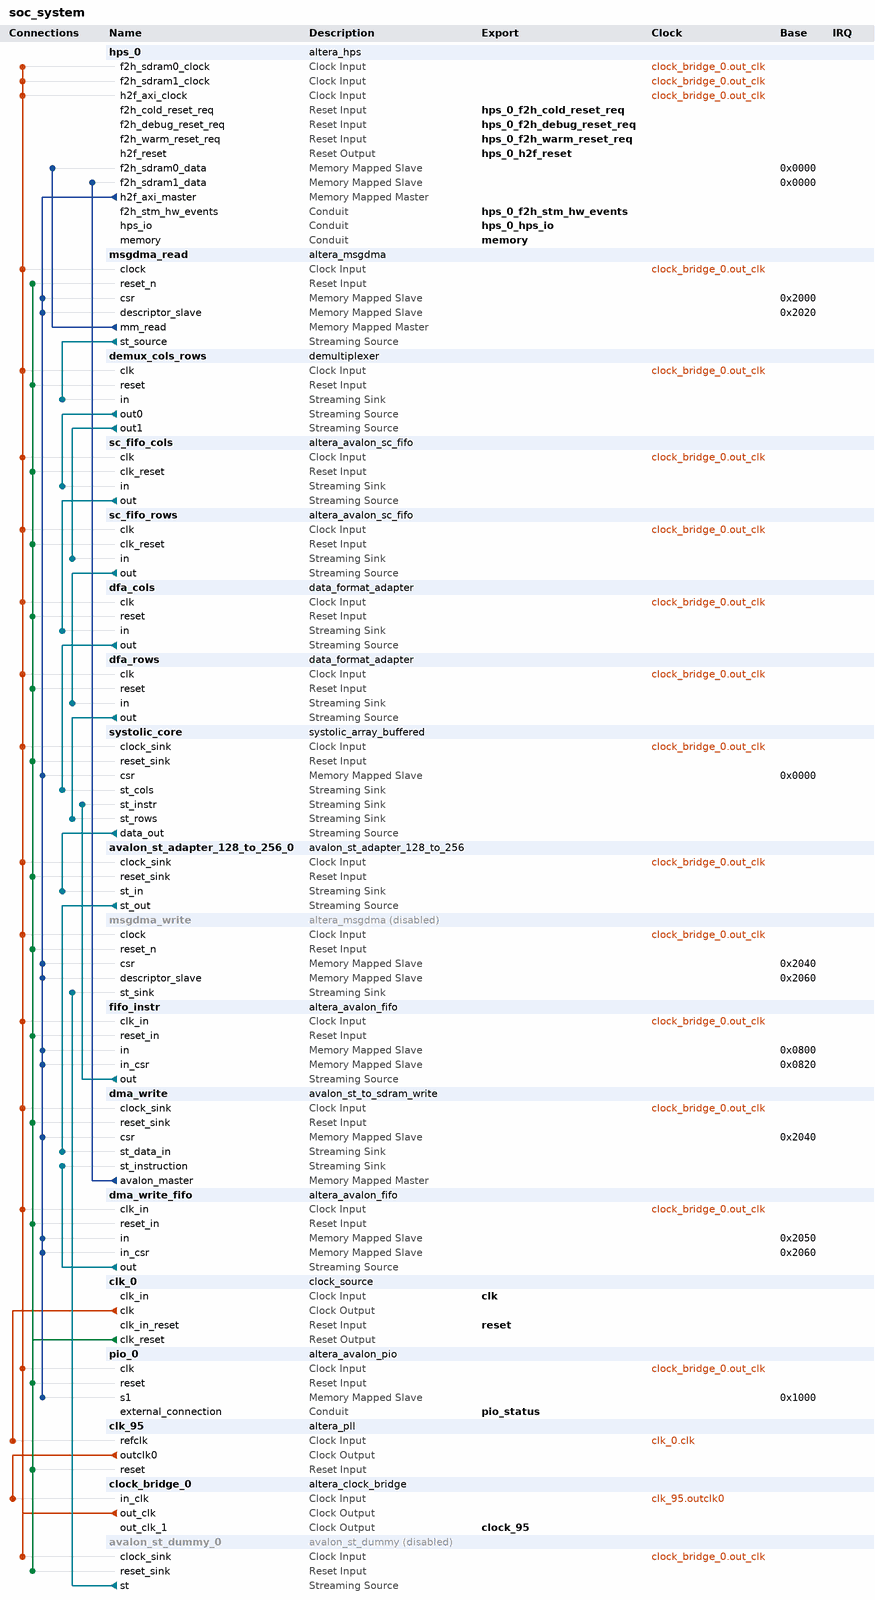
[diagram p0: system contents]
# Platform Designer (Qsys) system soc_system, Cyclone V 5CSEMA5F31C6
# Parameters at their usual value, and those the tool derives, are not listed.
package require -exact qsys 22.1
create_system soc_system
set_project_property DEVICE_FAMILY {Cyclone V}
set_project_property DEVICE 5CSEMA5F31C6

add_instance hps_0 altera_hps 22.1
set_instance_parameter_value hps_0 EMAC1_Mode RGMII
set_instance_parameter_value hps_0 EMAC1_PinMuxing {HPS I/O Set 0}
set_instance_parameter_value hps_0 F2SCLK_COLDRST_Enable true
set_instance_parameter_value hps_0 F2SCLK_DBGRST_Enable true
set_instance_parameter_value hps_0 F2SCLK_WARMRST_Enable true
set_instance_parameter_value hps_0 F2SDRAM_Type {Avalon-MM Read-Only,Avalon-MM Write-Only}
set_instance_parameter_value hps_0 F2SDRAM_Width 256,256
set_instance_parameter_value hps_0 F2SINTERRUPT_Enable false
set_instance_parameter_value hps_0 F2S_Width 0
set_instance_parameter_value hps_0 FPGA_PERIPHERAL_OUTPUT_CLOCK_FREQ_EMAC0_GTX_CLK 100
set_instance_parameter_value hps_0 FPGA_PERIPHERAL_OUTPUT_CLOCK_FREQ_EMAC0_MD_CLK 100.0
set_instance_parameter_value hps_0 FPGA_PERIPHERAL_OUTPUT_CLOCK_FREQ_EMAC1_GTX_CLK 100
set_instance_parameter_value hps_0 FPGA_PERIPHERAL_OUTPUT_CLOCK_FREQ_EMAC1_MD_CLK 100.0
set_instance_parameter_value hps_0 HPS_PROTOCOL DDR3
set_instance_parameter_value hps_0 I2C0_Mode I2C
set_instance_parameter_value hps_0 I2C0_PinMuxing {HPS I/O Set 0}
set_instance_parameter_value hps_0 I2C1_Mode I2C
set_instance_parameter_value hps_0 I2C1_PinMuxing {HPS I/O Set 0}
set_instance_parameter_value hps_0 LWH2F_Enable false
set_instance_parameter_value hps_0 MEM_BANKADDR_WIDTH 3
set_instance_parameter_value hps_0 MEM_CLK_FREQ 400.0
set_instance_parameter_value hps_0 MEM_COL_ADDR_WIDTH 10
set_instance_parameter_value hps_0 MEM_DQ_WIDTH 32
set_instance_parameter_value hps_0 MEM_DRV_STR RZQ/7
set_instance_parameter_value hps_0 MEM_ROW_ADDR_WIDTH 15
set_instance_parameter_value hps_0 MEM_RTT_NOM RZQ/4
set_instance_parameter_value hps_0 MEM_RTT_WR RZQ/4
set_instance_parameter_value hps_0 MEM_TCL 11
set_instance_parameter_value hps_0 MEM_TFAW_NS 30.0
set_instance_parameter_value hps_0 MEM_TRAS_NS 35.0
set_instance_parameter_value hps_0 MEM_TRCD_NS 13.75
set_instance_parameter_value hps_0 MEM_TRFC_NS 260.0
set_instance_parameter_value hps_0 MEM_TRP_NS 13.75
set_instance_parameter_value hps_0 MEM_VENDOR JEDEC
set_instance_parameter_value hps_0 MEM_WTCL 8
set_instance_parameter_value hps_0 QSPI_Mode {1 SS}
set_instance_parameter_value hps_0 QSPI_PinMuxing {HPS I/O Set 0}
set_instance_parameter_value hps_0 REF_CLK_FREQ 25.0
set_instance_parameter_value hps_0 S2FCLK_USER2CLK 5
set_instance_parameter_value hps_0 S2F_Width 2
set_instance_parameter_value hps_0 SDIO_Mode {4-bit Data}
set_instance_parameter_value hps_0 SDIO_PinMuxing {HPS I/O Set 0}
set_instance_parameter_value hps_0 SPIM1_Mode {Single Slave Select}
set_instance_parameter_value hps_0 SPIM1_PinMuxing {HPS I/O Set 0}
set_instance_parameter_value hps_0 STM_Enable true
set_instance_parameter_value hps_0 TIMING_BOARD_AC_SKEW 0.03
set_instance_parameter_value hps_0 TIMING_BOARD_AC_TO_CK_SKEW 0.0
set_instance_parameter_value hps_0 TIMING_BOARD_DQ_TO_DQS_SKEW 0.0
set_instance_parameter_value hps_0 TIMING_BOARD_MAX_CK_DELAY 0.03
set_instance_parameter_value hps_0 TIMING_BOARD_MAX_DQS_DELAY 0.02
set_instance_parameter_value hps_0 TIMING_BOARD_SKEW_BETWEEN_DQS 0.08
set_instance_parameter_value hps_0 TIMING_BOARD_SKEW_CKDQS_DIMM_MAX 0.16
set_instance_parameter_value hps_0 TIMING_BOARD_SKEW_CKDQS_DIMM_MIN 0.09
set_instance_parameter_value hps_0 TIMING_BOARD_SKEW_WITHIN_DQS 0.01
set_instance_parameter_value hps_0 TIMING_TDH 65
set_instance_parameter_value hps_0 TIMING_TDQSCK 255
set_instance_parameter_value hps_0 TIMING_TDQSQ 125
set_instance_parameter_value hps_0 TIMING_TDS 30
set_instance_parameter_value hps_0 TIMING_TIH 140
set_instance_parameter_value hps_0 TIMING_TIS 180
set_instance_parameter_value hps_0 TIMING_TQSH 0.4
set_instance_parameter_value hps_0 UART0_Mode {No Flow Control}
set_instance_parameter_value hps_0 UART0_PinMuxing {HPS I/O Set 0}
set_instance_parameter_value hps_0 USB1_Mode SDR
set_instance_parameter_value hps_0 USB1_PinMuxing {HPS I/O Set 0}
set_instance_parameter_value hps_0 desired_cfg_clk_mhz 100.0
set_instance_parameter_value hps_0 desired_qspi_clk_mhz 400.0

add_instance msgdma_read altera_msgdma 22.1
set_instance_parameter_value msgdma_read BURST_ENABLE 1
set_instance_parameter_value msgdma_read BURST_WRAPPING_SUPPORT 1
set_instance_parameter_value msgdma_read CHANNEL_ENABLE 1
set_instance_parameter_value msgdma_read CHANNEL_WIDTH 1
set_instance_parameter_value msgdma_read DATA_FIFO_DEPTH 512
set_instance_parameter_value msgdma_read DATA_WIDTH 256
set_instance_parameter_value msgdma_read DESCRIPTOR_FIFO_DEPTH 32
set_instance_parameter_value msgdma_read ENHANCED_FEATURES 0
set_instance_parameter_value msgdma_read ERROR_ENABLE 0
set_instance_parameter_value msgdma_read MAX_BURST_COUNT 128
set_instance_parameter_value msgdma_read MAX_BYTE 8192
set_instance_parameter_value msgdma_read MODE 1
set_instance_parameter_value msgdma_read PACKET_ENABLE 0
set_instance_parameter_value msgdma_read TRANSFER_TYPE {Full Word Accesses Only}

add_instance demux_cols_rows demultiplexer 22.1
set_instance_parameter_value demux_cols_rows bitsPerSymbol 8
set_instance_parameter_value demux_cols_rows errorWidth 0
set_instance_parameter_value demux_cols_rows inChannelWidth 1
set_instance_parameter_value demux_cols_rows numOutputInterfaces 2
set_instance_parameter_value demux_cols_rows symbolsPerBeat 32
set_instance_parameter_value demux_cols_rows useHighBitsOfChannel true
set_instance_parameter_value demux_cols_rows usePackets false

add_instance sc_fifo_cols altera_avalon_sc_fifo 22.1
set_instance_parameter_value sc_fifo_cols BITS_PER_SYMBOL 8
set_instance_parameter_value sc_fifo_cols CHANNEL_WIDTH 0
set_instance_parameter_value sc_fifo_cols ERROR_WIDTH 0
set_instance_parameter_value sc_fifo_cols FIFO_DEPTH 32
set_instance_parameter_value sc_fifo_cols SYMBOLS_PER_BEAT 32
set_instance_parameter_value sc_fifo_cols USE_FILL_LEVEL 0
set_instance_parameter_value sc_fifo_cols USE_MEMORY_BLOCKS 1
set_instance_parameter_value sc_fifo_cols USE_STORE_FORWARD 0

add_instance sc_fifo_rows altera_avalon_sc_fifo 22.1
set_instance_parameter_value sc_fifo_rows BITS_PER_SYMBOL 8
set_instance_parameter_value sc_fifo_rows CHANNEL_WIDTH 0
set_instance_parameter_value sc_fifo_rows ERROR_WIDTH 0
set_instance_parameter_value sc_fifo_rows FIFO_DEPTH 32
set_instance_parameter_value sc_fifo_rows SYMBOLS_PER_BEAT 32
set_instance_parameter_value sc_fifo_rows USE_FILL_LEVEL 0
set_instance_parameter_value sc_fifo_rows USE_MEMORY_BLOCKS 1
set_instance_parameter_value sc_fifo_rows USE_STORE_FORWARD 0

add_instance dfa_cols data_format_adapter 22.1
set_instance_parameter_value dfa_cols inBitsPerSymbol 8
set_instance_parameter_value dfa_cols inChannelWidth 0
set_instance_parameter_value dfa_cols inErrorWidth 0
set_instance_parameter_value dfa_cols inMaxChannel 0
set_instance_parameter_value dfa_cols inReadyLatency 0
set_instance_parameter_value dfa_cols inSymbolsPerBeat 32
set_instance_parameter_value dfa_cols inUseEmpty false
set_instance_parameter_value dfa_cols inUseEmptyPort AUTO
set_instance_parameter_value dfa_cols inUsePackets false
set_instance_parameter_value dfa_cols outSymbolsPerBeat 16
set_instance_parameter_value dfa_cols outUseEmpty false
set_instance_parameter_value dfa_cols outUseEmptyPort AUTO

add_instance dfa_rows data_format_adapter 22.1
set_instance_parameter_value dfa_rows inBitsPerSymbol 8
set_instance_parameter_value dfa_rows inChannelWidth 0
set_instance_parameter_value dfa_rows inErrorWidth 0
set_instance_parameter_value dfa_rows inMaxChannel 0
set_instance_parameter_value dfa_rows inReadyLatency 0
set_instance_parameter_value dfa_rows inSymbolsPerBeat 32
set_instance_parameter_value dfa_rows inUseEmpty false
set_instance_parameter_value dfa_rows inUseEmptyPort AUTO
set_instance_parameter_value dfa_rows inUsePackets false
set_instance_parameter_value dfa_rows outSymbolsPerBeat 16
set_instance_parameter_value dfa_rows outUseEmpty false
set_instance_parameter_value dfa_rows outUseEmptyPort AUTO

add_instance systolic_core systolic_array_buffered 1.0

add_instance avalon_st_adapter_128_to_256_0 avalon_st_adapter_128_to_256 1.0

add_instance msgdma_write altera_msgdma 22.1
set_instance_property msgdma_write ENABLED false
set_instance_parameter_value msgdma_write BURST_ENABLE 1
set_instance_parameter_value msgdma_write BURST_WRAPPING_SUPPORT 1
set_instance_parameter_value msgdma_write DATA_FIFO_DEPTH 512
set_instance_parameter_value msgdma_write DATA_WIDTH 256
set_instance_parameter_value msgdma_write DESCRIPTOR_FIFO_DEPTH 16
set_instance_parameter_value msgdma_write ENHANCED_FEATURES 0
set_instance_parameter_value msgdma_write ERROR_ENABLE 0
set_instance_parameter_value msgdma_write MAX_BURST_COUNT 128
set_instance_parameter_value msgdma_write MAX_BYTE 1024
set_instance_parameter_value msgdma_write MODE 2
set_instance_parameter_value msgdma_write PACKET_ENABLE 0
set_instance_parameter_value msgdma_write TRANSFER_TYPE {Aligned Accesses}

add_instance fifo_instr altera_avalon_fifo 22.1
set_instance_parameter_value fifo_instr bitsPerSymbol 8
set_instance_parameter_value fifo_instr channelWidth 0
set_instance_parameter_value fifo_instr errorWidth 0
set_instance_parameter_value fifo_instr fifoDepth 128
set_instance_parameter_value fifo_instr fifoInputInterfaceOptions AVALONMM_WRITE
set_instance_parameter_value fifo_instr fifoOutputInterfaceOptions AVALONST_SOURCE
set_instance_parameter_value fifo_instr singleClockMode true
set_instance_parameter_value fifo_instr symbolsPerBeat 4
set_instance_parameter_value fifo_instr useIRQ false
set_instance_parameter_value fifo_instr usePacket false
set_instance_parameter_value fifo_instr useReadControl false

add_instance dma_write avalon_st_to_sdram_write 1.0

add_instance dma_write_fifo altera_avalon_fifo 22.1
set_instance_parameter_value dma_write_fifo bitsPerSymbol 32
set_instance_parameter_value dma_write_fifo channelWidth 0
set_instance_parameter_value dma_write_fifo errorWidth 0
set_instance_parameter_value dma_write_fifo fifoDepth 64
set_instance_parameter_value dma_write_fifo fifoInputInterfaceOptions AVALONMM_WRITE
set_instance_parameter_value dma_write_fifo fifoOutputInterfaceOptions AVALONST_SOURCE
set_instance_parameter_value dma_write_fifo singleClockMode true
set_instance_parameter_value dma_write_fifo symbolsPerBeat 1
set_instance_parameter_value dma_write_fifo useIRQ false
set_instance_parameter_value dma_write_fifo usePacket false
set_instance_parameter_value dma_write_fifo useReadControl false

add_instance clk_0 clock_source 22.1
set_instance_parameter_value clk_0 clockFrequency 50000000

add_instance pio_0 altera_avalon_pio 22.1
set_instance_parameter_value pio_0 direction Input
set_instance_parameter_value pio_0 width 32

add_instance clk_95 altera_pll 22.1
set_instance_parameter_value clk_95 gui_device_speed_grade 1
set_instance_parameter_value clk_95 gui_number_of_clocks 1
set_instance_parameter_value clk_95 gui_operation_mode direct
set_instance_parameter_value clk_95 gui_output_clock_frequency0 95.0
set_instance_parameter_value clk_95 gui_pll_mode {Integer-N PLL}
set_instance_parameter_value clk_95 gui_reference_clock_frequency 50.0
set_instance_parameter_value clk_95 gui_use_locked false

add_instance clock_bridge_0 altera_clock_bridge 22.1
set_instance_parameter_value clock_bridge_0 DERIVED_CLOCK_RATE 95000000
set_instance_parameter_value clock_bridge_0 EXPLICIT_CLOCK_RATE 0
set_instance_parameter_value clock_bridge_0 NUM_CLOCK_OUTPUTS 2

add_instance avalon_st_dummy_0 avalon_st_dummy 1.0
set_instance_property avalon_st_dummy_0 ENABLED false

# connections
add_connection clk_0.clk clk_95.refclk clock
add_connection clk_95.outclk0 clock_bridge_0.in_clk clock
add_connection clock_bridge_0.out_clk avalon_st_adapter_128_to_256_0.clock_sink clock
add_connection clock_bridge_0.out_clk avalon_st_dummy_0.clock_sink clock
add_connection clock_bridge_0.out_clk demux_cols_rows.clk clock
add_connection clock_bridge_0.out_clk dfa_cols.clk clock
add_connection clock_bridge_0.out_clk dfa_rows.clk clock
add_connection clock_bridge_0.out_clk dma_write.clock_sink clock
add_connection clock_bridge_0.out_clk dma_write_fifo.clk_in clock
add_connection clock_bridge_0.out_clk fifo_instr.clk_in clock
add_connection clock_bridge_0.out_clk hps_0.f2h_sdram0_clock clock
add_connection clock_bridge_0.out_clk hps_0.f2h_sdram1_clock clock
add_connection clock_bridge_0.out_clk hps_0.h2f_axi_clock clock
add_connection clock_bridge_0.out_clk msgdma_read.clock clock
add_connection clock_bridge_0.out_clk msgdma_write.clock clock
add_connection clock_bridge_0.out_clk pio_0.clk clock
add_connection clock_bridge_0.out_clk sc_fifo_cols.clk clock
add_connection clock_bridge_0.out_clk sc_fifo_rows.clk clock
add_connection clock_bridge_0.out_clk systolic_core.clock_sink clock
add_connection clk_0.clk_reset avalon_st_adapter_128_to_256_0.reset_sink reset
add_connection clk_0.clk_reset avalon_st_dummy_0.reset_sink reset
add_connection clk_0.clk_reset clk_95.reset reset
add_connection clk_0.clk_reset demux_cols_rows.reset reset
add_connection clk_0.clk_reset dfa_cols.reset reset
add_connection clk_0.clk_reset dfa_rows.reset reset
add_connection clk_0.clk_reset dma_write.reset_sink reset
add_connection clk_0.clk_reset dma_write_fifo.reset_in reset
add_connection clk_0.clk_reset fifo_instr.reset_in reset
add_connection clk_0.clk_reset msgdma_read.reset_n reset
add_connection clk_0.clk_reset msgdma_write.reset_n reset
add_connection clk_0.clk_reset pio_0.reset reset
add_connection clk_0.clk_reset sc_fifo_cols.clk_reset reset
add_connection clk_0.clk_reset sc_fifo_rows.clk_reset reset
add_connection clk_0.clk_reset systolic_core.reset_sink reset
add_connection dma_write.avalon_master hps_0.f2h_sdram1_data avalon
set_connection_parameter_value dma_write.avalon_master/hps_0.f2h_sdram1_data baseAddress 0x0000
add_connection hps_0.h2f_axi_master dma_write.csr avalon
set_connection_parameter_value hps_0.h2f_axi_master/dma_write.csr baseAddress 0x2040
add_connection hps_0.h2f_axi_master dma_write_fifo.in avalon
set_connection_parameter_value hps_0.h2f_axi_master/dma_write_fifo.in baseAddress 0x2050
add_connection hps_0.h2f_axi_master dma_write_fifo.in_csr avalon
set_connection_parameter_value hps_0.h2f_axi_master/dma_write_fifo.in_csr baseAddress 0x2060
add_connection hps_0.h2f_axi_master fifo_instr.in avalon
set_connection_parameter_value hps_0.h2f_axi_master/fifo_instr.in baseAddress 0x0800
add_connection hps_0.h2f_axi_master fifo_instr.in_csr avalon
set_connection_parameter_value hps_0.h2f_axi_master/fifo_instr.in_csr baseAddress 0x0820
add_connection hps_0.h2f_axi_master msgdma_read.csr avalon
set_connection_parameter_value hps_0.h2f_axi_master/msgdma_read.csr baseAddress 0x2000
add_connection hps_0.h2f_axi_master msgdma_read.descriptor_slave avalon
set_connection_parameter_value hps_0.h2f_axi_master/msgdma_read.descriptor_slave baseAddress 0x2020
add_connection hps_0.h2f_axi_master msgdma_write.csr avalon
set_connection_parameter_value hps_0.h2f_axi_master/msgdma_write.csr baseAddress 0x2040
add_connection hps_0.h2f_axi_master msgdma_write.descriptor_slave avalon
set_connection_parameter_value hps_0.h2f_axi_master/msgdma_write.descriptor_slave baseAddress 0x2060
add_connection hps_0.h2f_axi_master pio_0.s1 avalon
set_connection_parameter_value hps_0.h2f_axi_master/pio_0.s1 baseAddress 0x1000
add_connection hps_0.h2f_axi_master systolic_core.csr avalon
set_connection_parameter_value hps_0.h2f_axi_master/systolic_core.csr baseAddress 0x0000
add_connection msgdma_read.mm_read hps_0.f2h_sdram0_data avalon
set_connection_parameter_value msgdma_read.mm_read/hps_0.f2h_sdram0_data baseAddress 0x0000
add_connection avalon_st_adapter_128_to_256_0.st_out dma_write.st_data_in avalon_streaming
add_connection avalon_st_dummy_0.st msgdma_write.st_sink avalon_streaming
add_connection demux_cols_rows.out0 sc_fifo_cols.in avalon_streaming
add_connection demux_cols_rows.out1 sc_fifo_rows.in avalon_streaming
add_connection dfa_cols.out systolic_core.st_cols avalon_streaming
add_connection dfa_rows.out systolic_core.st_rows avalon_streaming
add_connection dma_write_fifo.out dma_write.st_instruction avalon_streaming
add_connection fifo_instr.out systolic_core.st_instr avalon_streaming
add_connection msgdma_read.st_source demux_cols_rows.in avalon_streaming
add_connection sc_fifo_cols.out dfa_cols.in avalon_streaming
add_connection sc_fifo_rows.out dfa_rows.in avalon_streaming
add_connection systolic_core.data_out avalon_st_adapter_128_to_256_0.st_in avalon_streaming

# exported interfaces
add_interface clk clock sink
set_interface_property clk EXPORT_OF clk_0.clk_in
add_interface clock_95 clock source
set_interface_property clock_95 EXPORT_OF clock_bridge_0.out_clk_1
add_interface hps_0_f2h_cold_reset_req reset sink
set_interface_property hps_0_f2h_cold_reset_req EXPORT_OF hps_0.f2h_cold_reset_req
add_interface hps_0_f2h_debug_reset_req reset sink
set_interface_property hps_0_f2h_debug_reset_req EXPORT_OF hps_0.f2h_debug_reset_req
add_interface hps_0_f2h_stm_hw_events conduit end
set_interface_property hps_0_f2h_stm_hw_events EXPORT_OF hps_0.f2h_stm_hw_events
add_interface hps_0_f2h_warm_reset_req reset sink
set_interface_property hps_0_f2h_warm_reset_req EXPORT_OF hps_0.f2h_warm_reset_req
add_interface hps_0_h2f_reset reset source
set_interface_property hps_0_h2f_reset EXPORT_OF hps_0.h2f_reset
add_interface hps_0_hps_io conduit end
set_interface_property hps_0_hps_io EXPORT_OF hps_0.hps_io
add_interface memory conduit end
set_interface_property memory EXPORT_OF hps_0.memory
add_interface pio_status conduit end
set_interface_property pio_status EXPORT_OF pio_0.external_connection
add_interface reset reset sink
set_interface_property reset EXPORT_OF clk_0.clk_in_reset

set_interconnect_requirement {$system} qsys_mm.clockCrossingAdapter HANDSHAKE
set_interconnect_requirement {$system} qsys_mm.maxAdditionalLatency 1

save_system soc_system.qsys
